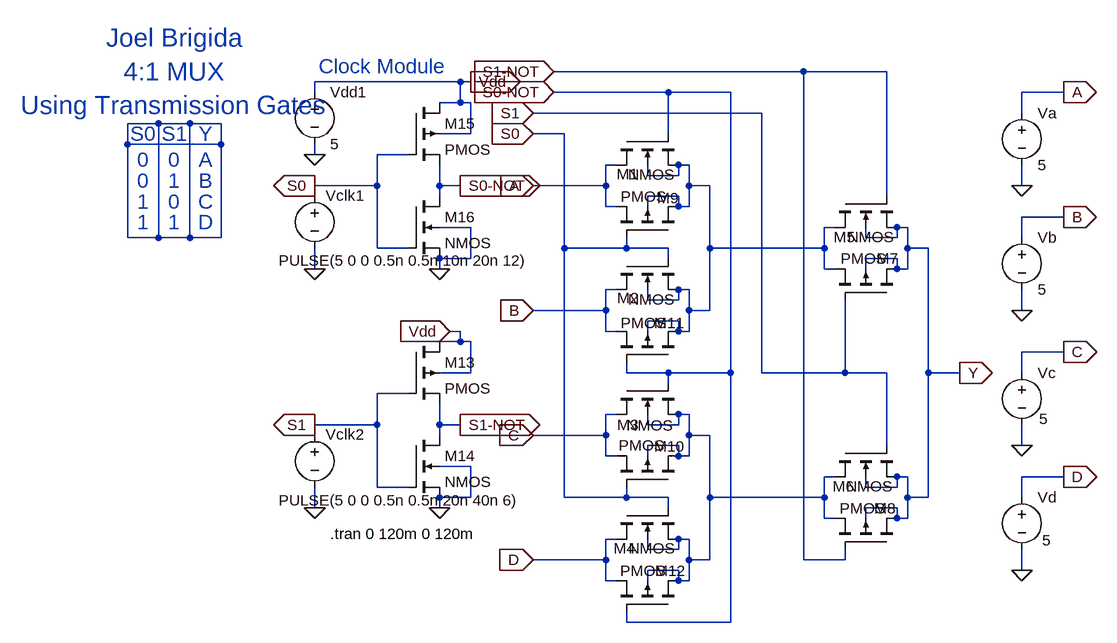
[diagram p0: schematic 4to1MUX-Transmission.asc]
4to1MUX-Transmission.asc, the LTspice schematic file:
Version 4
SHEET 1 880 680
WIRE -192 -224 -576 -224
WIRE -64 -224 -192 -224
WIRE -720 -208 -944 -208
WIRE -704 -208 -720 -208
WIRE -944 -192 -944 -208
WIRE -400 -192 -576 -192
WIRE -304 -192 -400 -192
WIRE 208 -192 144 -192
WIRE -720 -176 -720 -208
WIRE -720 -176 -752 -176
WIRE -704 -176 -720 -176
WIRE -256 -160 -608 -160
WIRE 144 -160 144 -192
WIRE -1184 -144 -1232 -144
WIRE -1136 -144 -1184 -144
WIRE -1088 -144 -1136 -144
WIRE -704 -128 -704 -176
WIRE -704 -128 -752 -128
WIRE -560 -128 -608 -128
WIRE -400 -128 -400 -192
WIRE -1232 -112 -1232 -144
WIRE -1088 -112 -1088 -144
WIRE -1088 -112 -1232 -112
WIRE -944 -96 -944 -112
WIRE -800 -96 -848 -96
WIRE -480 -80 -496 -80
WIRE -368 -80 -384 -80
WIRE -432 -64 -432 -80
WIRE -384 -64 -384 -80
WIRE -384 -64 -432 -64
WIRE -848 -48 -848 -96
WIRE -848 -48 -944 -48
WIRE -752 -48 -752 -80
WIRE -720 -48 -752 -48
WIRE -496 -48 -496 -80
WIRE -496 -48 -608 -48
WIRE -368 -48 -368 -80
WIRE -336 -48 -368 -48
WIRE 144 -48 144 -80
WIRE -944 -32 -944 -48
WIRE -752 -32 -752 -48
WIRE -384 -32 -432 -32
WIRE -64 -32 -64 -224
WIRE -496 -16 -496 -48
WIRE -480 -16 -496 -16
WIRE -432 -16 -432 -32
WIRE -384 -16 -384 -32
WIRE -368 -16 -368 -48
WIRE -368 -16 -384 -16
WIRE 208 0 144 0
WIRE -704 16 -752 16
WIRE -144 16 -160 16
WIRE -32 16 -48 16
WIRE -1232 32 -1232 -112
WIRE -1184 32 -1184 -144
WIRE -1184 32 -1232 32
WIRE -1136 32 -1136 -144
WIRE -1136 32 -1184 32
WIRE -1088 32 -1088 -112
WIRE -1088 32 -1136 32
WIRE -96 32 -96 16
WIRE -48 32 -48 16
WIRE -48 32 -96 32
WIRE 144 32 144 0
WIRE -848 48 -848 -48
WIRE -800 48 -848 48
WIRE -560 48 -560 -128
WIRE -464 48 -464 32
WIRE -464 48 -560 48
WIRE -400 48 -464 48
WIRE -336 48 -336 -48
WIRE -160 48 -160 16
WIRE -160 48 -336 48
WIRE -32 48 -32 16
WIRE 0 48 -32 48
WIRE -704 64 -704 16
WIRE -704 64 -752 64
WIRE -400 64 -400 48
WIRE -48 64 -96 64
WIRE -944 80 -944 48
WIRE -752 80 -752 64
WIRE -160 80 -160 48
WIRE -144 80 -160 80
WIRE -96 80 -96 64
WIRE -48 80 -48 64
WIRE -32 80 -32 48
WIRE -32 80 -48 80
WIRE -480 112 -496 112
WIRE -368 112 -384 112
WIRE -432 128 -432 112
WIRE -384 128 -384 112
WIRE -384 128 -432 128
WIRE -496 144 -496 112
WIRE -496 144 -608 144
WIRE -368 144 -368 112
WIRE -336 144 -336 48
WIRE -336 144 -368 144
WIRE 144 144 144 112
WIRE -384 160 -432 160
WIRE -720 176 -736 176
WIRE -496 176 -496 144
WIRE -480 176 -496 176
WIRE -432 176 -432 160
WIRE -384 176 -384 160
WIRE -368 176 -368 144
WIRE -368 176 -384 176
WIRE -720 192 -720 176
WIRE -720 192 -752 192
WIRE -704 192 -720 192
WIRE 208 208 144 208
WIRE -704 240 -704 192
WIRE -704 240 -752 240
WIRE -464 240 -464 224
WIRE -400 240 -464 240
WIRE -304 240 -304 -192
WIRE -304 240 -400 240
WIRE -256 240 -256 -160
WIRE -128 240 -128 128
WIRE -128 240 -256 240
WIRE -64 240 -128 240
WIRE 0 240 0 48
WIRE 48 240 0 240
WIRE 144 240 144 208
WIRE -400 256 -400 240
WIRE -800 272 -848 272
WIRE -480 304 -496 304
WIRE -368 304 -384 304
WIRE -848 320 -848 272
WIRE -848 320 -944 320
WIRE -752 320 -752 288
WIRE -720 320 -752 320
WIRE -432 320 -432 304
WIRE -384 320 -384 304
WIRE -384 320 -432 320
WIRE -944 336 -944 320
WIRE -752 336 -752 320
WIRE -496 336 -496 304
WIRE -496 336 -608 336
WIRE -368 336 -368 304
WIRE -336 336 -368 336
WIRE -384 352 -432 352
WIRE -64 352 -64 240
WIRE 144 352 144 320
WIRE -496 368 -496 336
WIRE -480 368 -496 368
WIRE -432 368 -432 352
WIRE -384 368 -384 352
WIRE -368 368 -368 336
WIRE -368 368 -384 368
WIRE -704 384 -752 384
WIRE -144 400 -160 400
WIRE -32 400 -48 400
WIRE 208 400 144 400
WIRE -848 416 -848 320
WIRE -800 416 -848 416
WIRE -96 416 -96 400
WIRE -48 416 -48 400
WIRE -48 416 -96 416
WIRE -704 432 -704 384
WIRE -704 432 -752 432
WIRE -560 432 -560 48
WIRE -464 432 -464 416
WIRE -464 432 -560 432
WIRE -400 432 -464 432
WIRE -336 432 -336 336
WIRE -160 432 -160 400
WIRE -160 432 -336 432
WIRE -32 432 -32 400
WIRE 0 432 0 240
WIRE 0 432 -32 432
WIRE 144 432 144 400
WIRE -944 448 -944 416
WIRE -752 448 -752 432
WIRE -400 448 -400 432
WIRE -48 448 -96 448
WIRE -160 464 -160 432
WIRE -144 464 -160 464
WIRE -96 464 -96 448
WIRE -48 464 -48 448
WIRE -32 464 -32 432
WIRE -32 464 -48 464
WIRE -480 496 -496 496
WIRE -368 496 -384 496
WIRE -432 512 -432 496
WIRE -384 512 -384 496
WIRE -384 512 -432 512
WIRE -496 528 -496 496
WIRE -496 528 -608 528
WIRE -368 528 -368 496
WIRE -336 528 -336 432
WIRE -336 528 -368 528
WIRE -192 528 -192 -224
WIRE -128 528 -128 512
WIRE -128 528 -192 528
WIRE -384 544 -432 544
WIRE 144 544 144 512
WIRE -496 560 -496 528
WIRE -480 560 -496 560
WIRE -432 560 -432 544
WIRE -384 560 -384 544
WIRE -368 560 -368 528
WIRE -368 560 -384 560
WIRE -464 624 -464 608
WIRE -304 624 -304 240
WIRE -304 624 -464 624
FLAG 48 240 Y
IOPIN 48 240 Out
FLAG -608 -48 A
IOPIN -608 -48 In
FLAG -608 144 B
IOPIN -608 144 In
FLAG -608 336 C
IOPIN -608 336 In
FLAG -608 528 D
IOPIN -608 528 In
FLAG -608 -160 S1
IOPIN -608 -160 In
FLAG -608 -128 S0
IOPIN -608 -128 In
FLAG -576 -192 S0-NOT
IOPIN -576 -192 In
FLAG -576 -224 S1-NOT
IOPIN -576 -224 In
FLAG -752 80 0
FLAG -944 80 0
FLAG -944 -48 S0
IOPIN -944 -48 Out
FLAG -720 -48 S0-NOT
IOPIN -720 -48 Out
FLAG -944 -96 0
FLAG 144 -48 0
FLAG 144 144 0
FLAG 144 352 0
FLAG 144 544 0
FLAG 208 -192 A
IOPIN 208 -192 Out
FLAG 208 0 B
IOPIN 208 0 Out
FLAG 208 208 C
IOPIN 208 208 Out
FLAG 208 400 D
IOPIN 208 400 Out
FLAG -752 448 0
FLAG -944 448 0
FLAG -944 320 S1
IOPIN -944 320 Out
FLAG -720 320 S1-NOT
IOPIN -720 320 Out
FLAG -704 -208 Vdd
IOPIN -704 -208 Out
FLAG -736 176 Vdd
IOPIN -736 176 In
SYMBOL nmos4 -480 -128 M90
WINDOW 0 62 34 VLeft 2
WINDOW 3 63 90 VLeft 2
SYMATTR InstName M1
SYMBOL nmos4 -480 64 M90
WINDOW 0 61 35 VLeft 2
WINDOW 3 63 90 VLeft 2
SYMATTR InstName M2
SYMBOL nmos4 -480 256 M90
WINDOW 0 64 35 VLeft 2
WINDOW 3 65 88 VLeft 2
SYMATTR InstName M3
SYMBOL nmos4 -480 448 M90
WINDOW 0 62 30 VLeft 2
WINDOW 3 62 91 VLeft 2
SYMATTR InstName M4
SYMBOL nmos4 -144 -32 M90
WINDOW 0 63 32 VLeft 2
WINDOW 3 63 92 VLeft 2
SYMATTR InstName M5
SYMBOL nmos4 -144 352 M90
WINDOW 0 63 31 VLeft 2
WINDOW 3 63 90 VLeft 2
SYMATTR InstName M6
SYMBOL pmos4 -48 128 M270
WINDOW 0 64 31 VLeft 2
WINDOW 3 64 87 VLeft 2
SYMATTR InstName M7
SYMBOL pmos4 -48 512 M270
WINDOW 0 63 35 VLeft 2
WINDOW 3 63 88 VLeft 2
SYMATTR InstName M8
SYMBOL pmos4 -384 32 M270
WINDOW 0 61 33 VLeft 2
WINDOW 3 63 89 VLeft 2
SYMATTR InstName M9
SYMBOL pmos4 -384 416 M270
WINDOW 0 63 38 VLeft 2
WINDOW 3 64 92 VLeft 2
SYMATTR InstName M10
SYMBOL pmos4 -384 224 M270
WINDOW 0 61 38 VLeft 2
WINDOW 3 61 89 VLeft 2
SYMATTR InstName M11
SYMBOL pmos4 -384 608 M270
WINDOW 0 63 36 VLeft 2
WINDOW 3 63 90 VLeft 2
SYMATTR InstName M12
SYMBOL pmos4 -800 -176 R0
SYMATTR InstName M15
SYMBOL nmos4 -800 -32 R0
SYMATTR InstName M16
SYMBOL voltage -944 -48 R0
WINDOW 3 -55 115 Left 2
WINDOW 123 0 0 Left 0
WINDOW 39 0 0 Left 0
WINDOW 0 17 15 Left 2
SYMATTR Value PULSE(5 0 0 0.5n 0.5n 10n 20n 12)
SYMATTR InstName Vclk1
SYMBOL voltage -944 -208 R0
SYMATTR InstName Vdd1
SYMATTR Value 5
SYMBOL voltage 144 -176 R0
WINDOW 123 0 0 Left 0
WINDOW 39 0 0 Left 0
SYMATTR InstName Va
SYMATTR Value 5
SYMBOL voltage 144 16 R0
WINDOW 123 0 0 Left 0
WINDOW 39 0 0 Left 0
SYMATTR InstName Vb
SYMATTR Value 5
SYMBOL voltage 144 224 R0
WINDOW 3 27 87 Left 2
WINDOW 123 0 0 Left 0
WINDOW 39 0 0 Left 0
SYMATTR Value 5
SYMATTR InstName Vc
SYMBOL voltage 144 416 R0
WINDOW 3 31 82 Left 2
WINDOW 123 0 0 Left 0
WINDOW 39 0 0 Left 0
SYMATTR Value 5
SYMATTR InstName Vd
SYMBOL pmos4 -800 192 R0
SYMATTR InstName M13
SYMBOL nmos4 -800 336 R0
SYMATTR InstName M14
SYMBOL voltage -944 320 R0
WINDOW 3 -55 116 Left 2
WINDOW 123 0 0 Left 0
WINDOW 39 0 0 Left 0
WINDOW 0 17 15 Left 2
SYMATTR Value PULSE(5 0 0 0.5n 0.5n 20n 40n 6)
SYMATTR InstName Vclk2
TEXT -1160 -224 Center 4 ;Joel Brigida\n4:1 MUX\nUsing Transmission Gates
TEXT -1208 -128 Center 3 ;S0
TEXT -1160 -128 Center 3 ;S1
TEXT -1112 -128 Center 3 ;Y
TEXT -1208 -88 Center 3 ;0
TEXT -1160 -88 Center 3 ;0
TEXT -1208 -56 Center 3 ;0
TEXT -1160 -24 Center 3 ;0
TEXT -1208 -24 Center 3 ;1
TEXT -1160 -56 Center 3 ;1
TEXT -1208 8 Center 3 ;1
TEXT -1160 8 Center 3 ;1
TEXT -920 488 Left 2 !.tran 0 120m 0 120m
TEXT -840 -232 Center 3 ;Clock Module
TEXT -1112 -88 Center 3 ;A
TEXT -1112 -56 Center 3 ;B
TEXT -1112 -24 Center 3 ;C
TEXT -1112 8 Center 3 ;D

The netlist it stands for:
* 4to1MUX-Transmission.asc
M1 A S0-NOT N002 N002 NMOS
M2 B S0 N002 N002 NMOS
M3 C S0-NOT N003 N003 NMOS
M4 D S0 N003 N003 NMOS
M5 N002 S1-NOT Y Y NMOS
M6 N003 S1 Y Y NMOS
M7 Y S1 N002 Y PMOS
M8 Y S1-NOT N003 Y PMOS
M9 N002 S0 A N002 PMOS
M10 N003 S0 C N003 PMOS
M11 N002 S0-NOT B N002 PMOS
M12 N003 S0-NOT D N003 PMOS
M15 Vdd S0 S0-NOT Vdd PMOS
M16 S0-NOT S0 0 0 NMOS
Vclk1 S0 0 PULSE(5 0 0 0.5n 0.5n 10n 20n 12)
Vdd1 Vdd 0 5
Va A 0 5
Vb B 0 5
Vc C 0 5
Vd D 0 5
M13 Vdd S1 S1-NOT Vdd PMOS
M14 S1-NOT S1 0 0 NMOS
Vclk2 S1 0 PULSE(5 0 0 0.5n 0.5n 20n 40n 6)
.model NMOS NMOS
.model PMOS PMOS
.lib standard.mos
* Joel Brigida
* 4:1 MUX
* Using Transmission Gates
* S0
* S1
* Y
* 0
* 0
* 0
* 0
* 1
* 1
* 1
* 1
.tran 0 120m 0 120m
* Clock Module
* A
* B
* C
* D
.backanno
.end